# EAGLE design Loop Mux V2 (EAGLE 9.2.2)
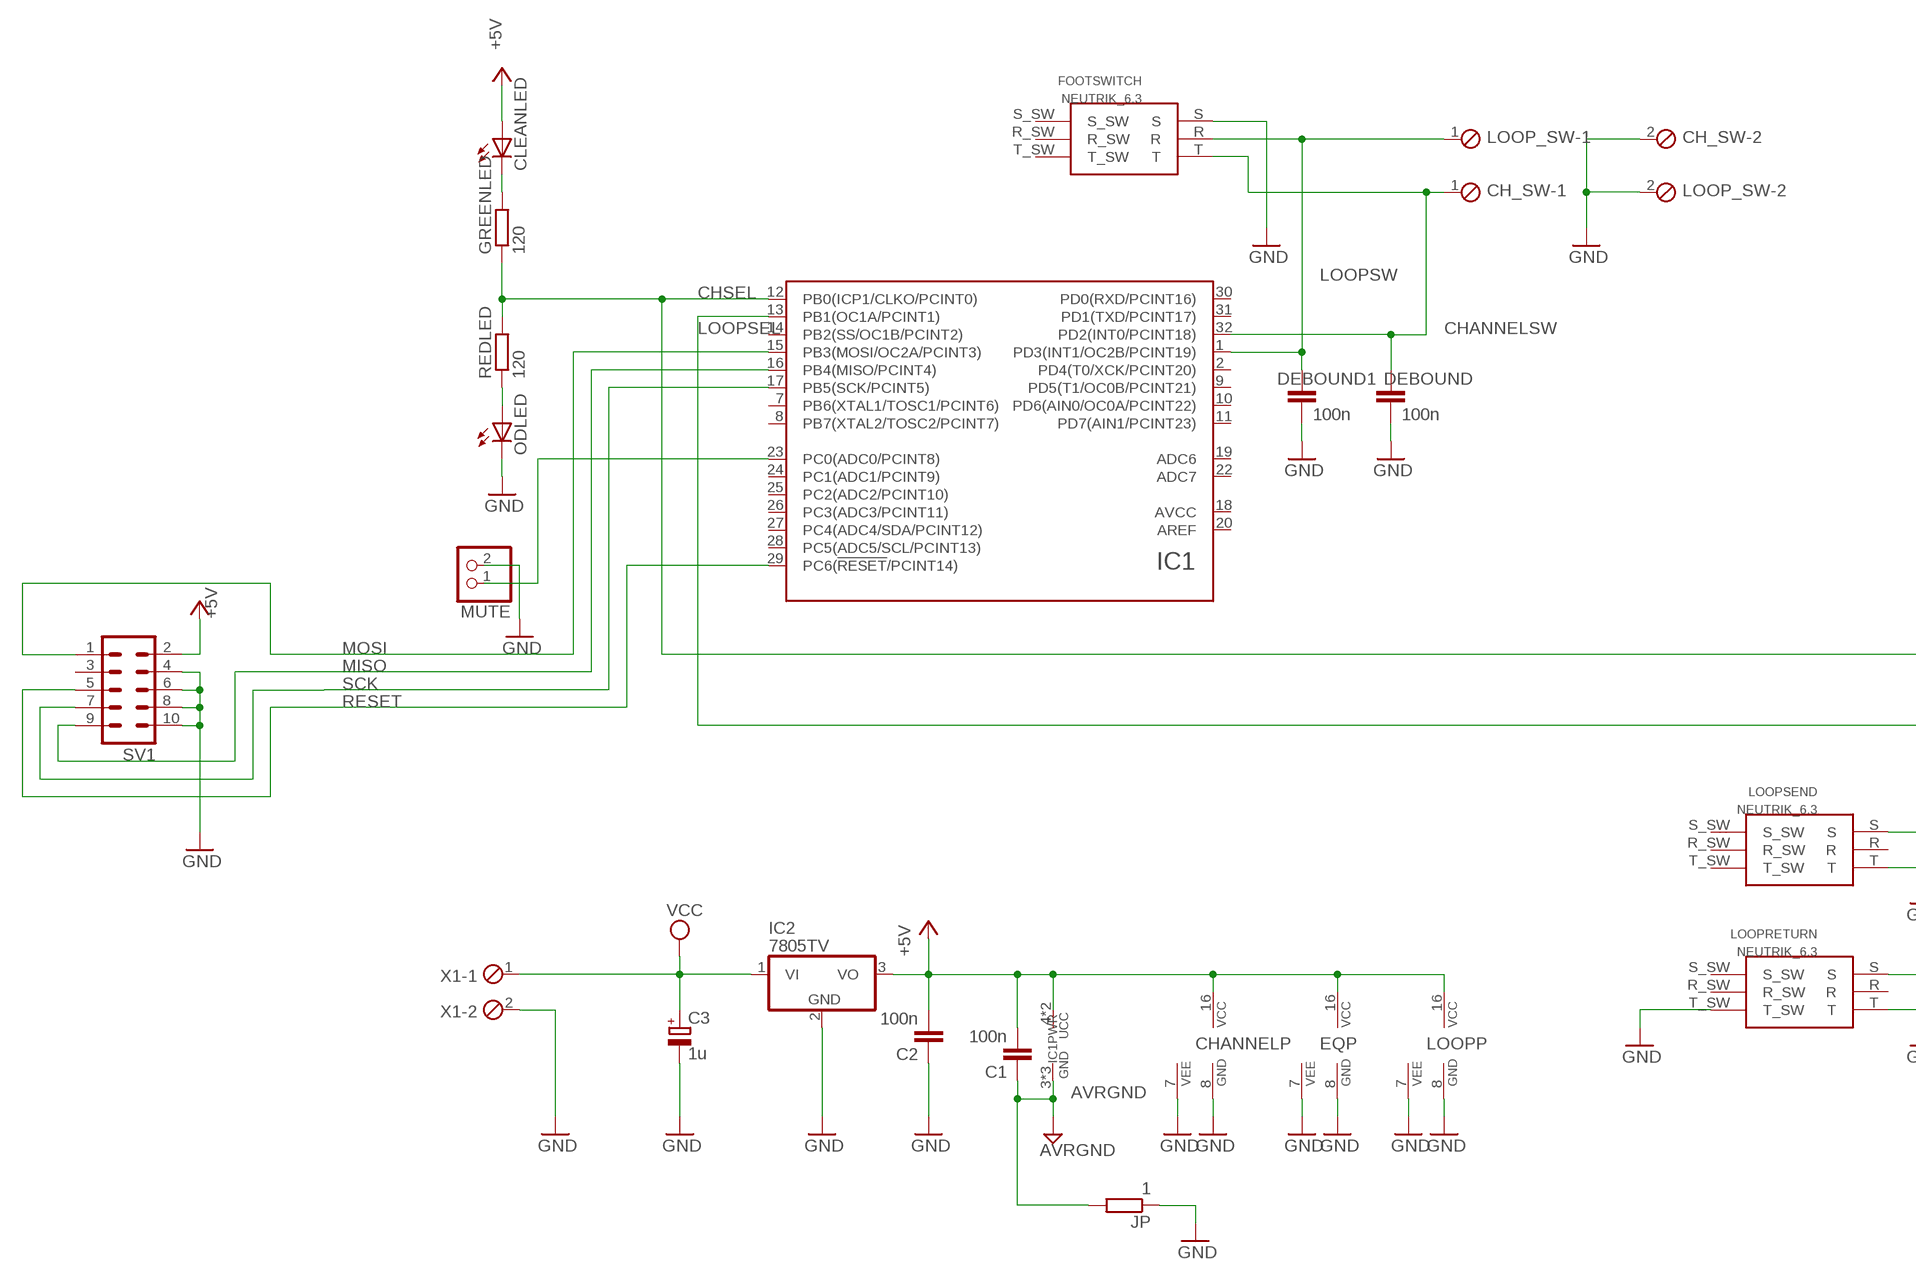
[diagram p0: schematic, sheet 1, part 1 of 2]
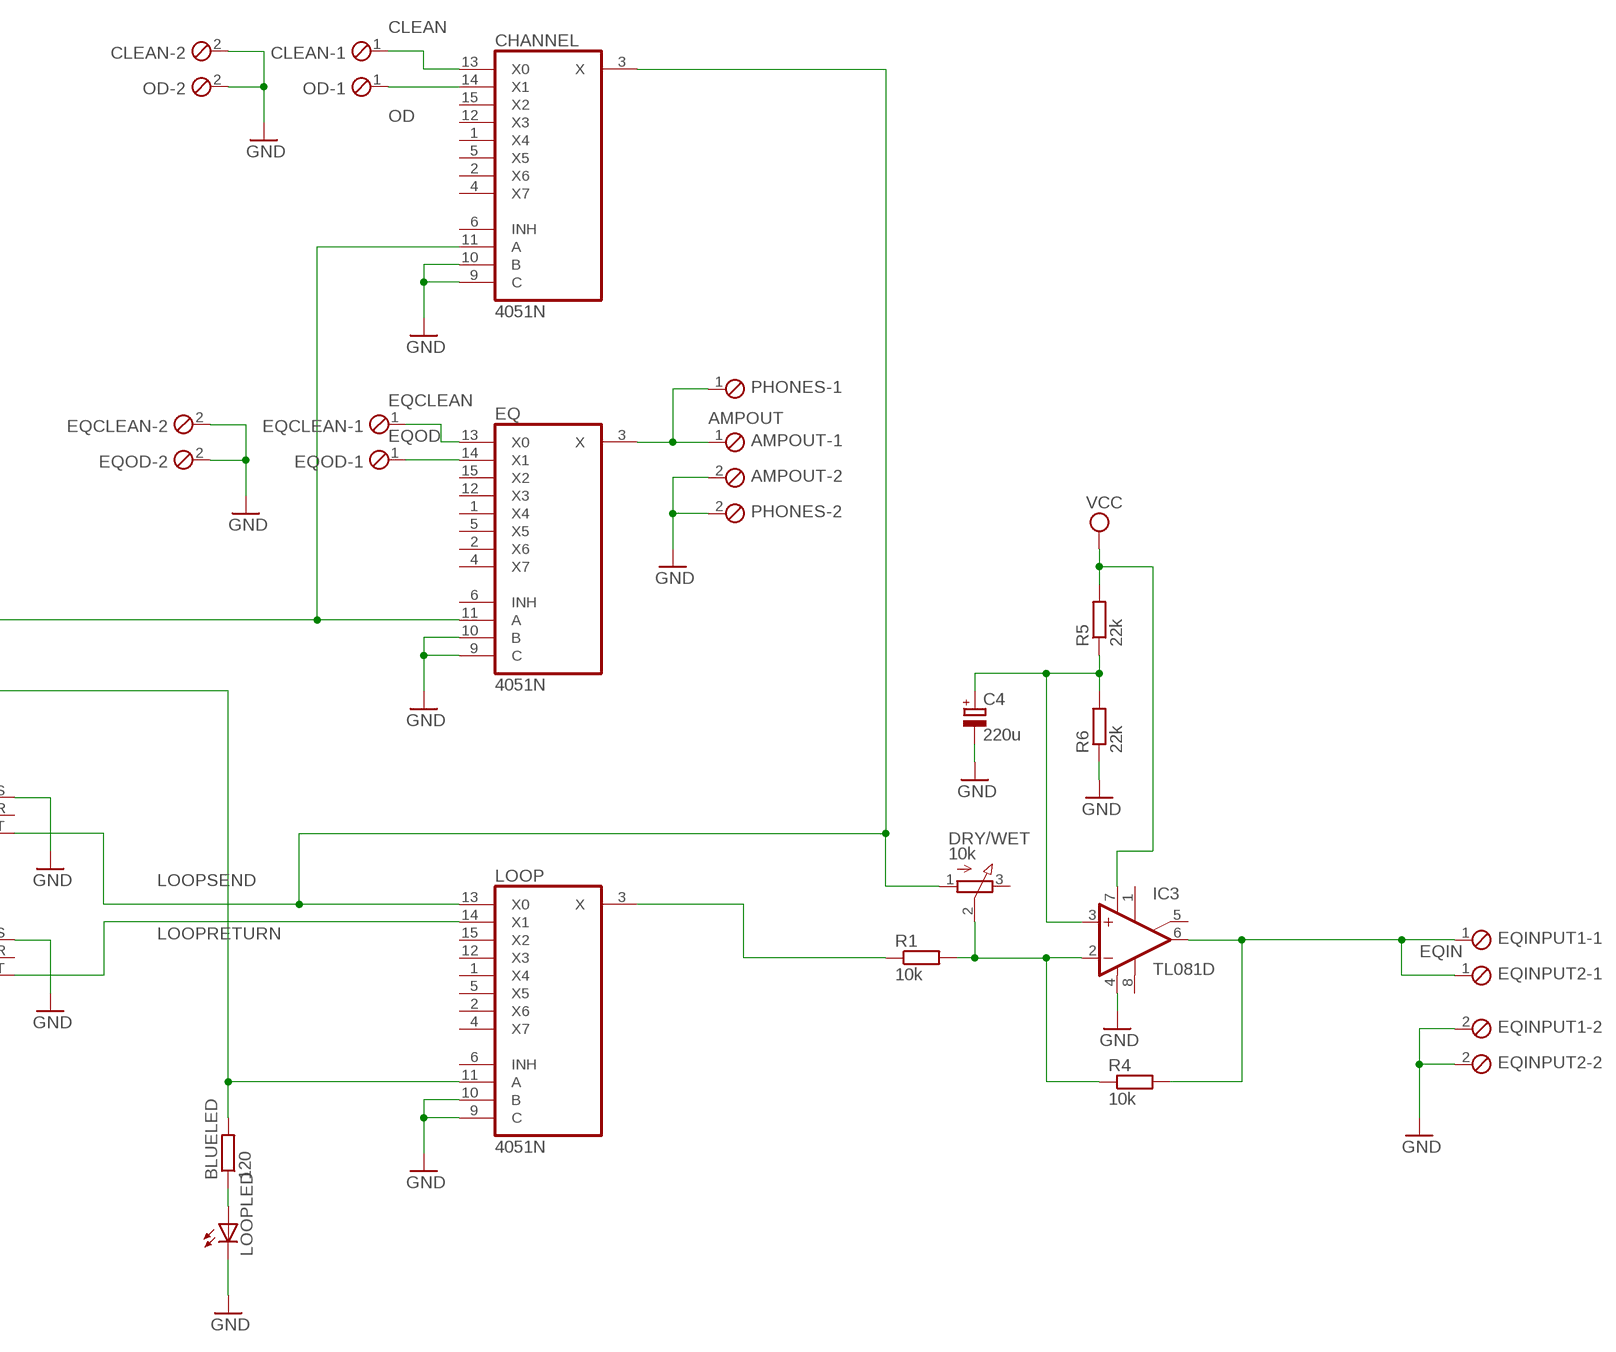
[diagram p1: schematic, sheet 1, part 2 of 2]

## Parts
AMPOUT  MPT2  [2POL254]
BLUELED  120  R-EU_R0805  [R0805]
C1  100n  C-EUC1206  [C1206]
C2  100n  C-EUC1206  [C1206]
C3  1u  CPOL-EUE2-5  [E2-5]
C4  220u  CPOL-EUE2.5-5  [E2,5-5]
CH_SW  MPT2  [2POL254]
CHANNEL  4051N  [DIL16]
CLEAN  MPT2  [2POL254]
CLEANLED  LED5MM  [LED5MM]
DEBOUND  100n  C-EUC1206  [C1206]
DEBOUND1  100n  C-EUC1206  [C1206]
DRY/WET  10k  3RP/1610N  [3RP/1610N]
EQ  4051N  [DIL16]
EQCLEAN  MPT2  [2POL254]
EQINPUT1  MPT2  [2POL254]
EQINPUT2  MPT2  [2POL254]
EQOD  MPT2  [2POL254]
FOOTSWITCH  NEUTRIK_6.3  [NEUTRIK_6.3]
GREENLED  120  R-EU_R0805  [R0805]
IC1  ATMEGA48/88/168/328-AU  [TQFP32-08]
IC2  7805TV  [TO220V]
IC3  TL081D  [SO08]
JP  1  R-EU_R0805  [R0805]
LOOP  4051N  [DIL16]
LOOP_SW  MPT2  [2POL254]
LOOPLED  LED5MM  [LED5MM]
LOOPRETURN  NEUTRIK_6.3  [NEUTRIK_6.3]
LOOPSEND  NEUTRIK_6.3  [NEUTRIK_6.3]
MUTE  PINHD-1X2  [1X02]
OD  MPT2  [2POL254]
ODLED  LED5MM  [LED5MM]
PHONES  MPT2  [2POL254]
R1  10k  R-EU_R0805  [R0805]
R4  10k  R-EU_R0805  [R0805]
R5  22k  R-EU_R0805  [R0805]
R6  22k  R-EU_R0805  [R0805]
REDLED  120  R-EU_R0805  [R0805]
SV1  MA05-2  [MA05-2]
X1  MPT2  [2POL254]

## Nets
+5V: C1.2 C2.2 CHANNEL.16(VCC) CLEANLED.A EQ.16(VCC) IC1.4(UCC) IC1.6(UCC) IC2.3(VO) LOOP.16(VCC) SV1.2
AMPOUT: AMPOUT.1 EQ.3(X) PHONES.1
AVRGND: C1.1 IC1.3(GND) IC1.5(GND) IC1.21(GND) JP.2
CHANNELSW: CH_SW.1 DEBOUND.1 FOOTSWITCH.T IC1.32(PD2(INT0/PCINT18))
CHSEL: CHANNEL.11(A) EQ.11(A) GREENLED.1 IC1.12(PB0(ICP1/CLKO/PCINT0)) REDLED.2
CLEAN: CHANNEL.13(X0) CLEAN.1
EQCLEAN: EQ.13(X0) EQCLEAN.1
EQIN: EQINPUT1.1 EQINPUT2.1 IC3.6(OUT) R4.2
EQOD: EQ.14(X1) EQOD.1
GND: AMPOUT.2 C2.1 C3.- C4.- CH_SW.2 CHANNEL.7(VEE) CHANNEL.8(GND) CHANNEL.9(C) CHANNEL.10(B) CLEAN.2 DEBOUND1.2 DEBOUND.2 EQ.7(VEE) EQ.8(GND) EQ.9(C) EQ.10(B) EQCLEAN.2 EQINPUT1.2 EQINPUT2.2 EQOD.2 FOOTSWITCH.S IC2.2(GND) IC3.4(V-) JP.1 LOOP.7(VEE) LOOP.8(GND) LOOP.9(C) LOOP.10(B) LOOP_SW.2 LOOPLED.K(C) LOOPRETURN.S LOOPRETURN.T_SW LOOPSEND.S MUTE.2 OD.2 ODLED.K(C) PHONES.2 R6.1 SV1.4 SV1.6 SV1.8 SV1.10 X1.2
LOOPRETURN: LOOP.14(X1) LOOPRETURN.T
LOOPSEL: BLUELED.2 IC1.13(PB1(OC1A/PCINT1)) LOOP.11(A)
LOOPSEND: CHANNEL.3(X) DRY/WET.1(A) LOOP.13(X0) LOOPSEND.T
LOOPSW: DEBOUND1.1 FOOTSWITCH.R IC1.1(PD3(INT1/OC2B/PCINT19)) LOOP_SW.1
MISO: IC1.16(PB4(MISO/PCINT4)) SV1.9
MOSI: IC1.15(PB3(MOSI/OC2A/PCINT3)) SV1.1
N$1: ODLED.A REDLED.1
N$2: IC1.23(PC0(ADC0/PCINT8)) MUTE.1
N$3: CLEANLED.K(C) GREENLED.2
N$7: LOOP.3(X) R1.1
N$9: DRY/WET.2(S) IC3.2(-IN) R1.2 R4.1
N$10: BLUELED.1 LOOPLED.A
N$12: C4.+ IC3.3(+IN) R5.1 R6.2
OD: CHANNEL.14(X1) OD.1
RESET: IC1.29(PC6(!RESET!/PCINT14)) SV1.5
SCK: IC1.17(PB5(SCK/PCINT5)) SV1.7
VCC: C3.+ IC2.1(VI) IC3.7(V+) R5.2 X1.1
Unconnected: CHANNEL.1(X4) CHANNEL.2(X6) CHANNEL.4(X7) CHANNEL.5(X5) CHANNEL.6(INH) CHANNEL.12(X3) CHANNEL.15(X2) DRY/WET.3(E) EQ.1(X4) EQ.2(X6) EQ.4(X7) EQ.5(X5) EQ.6(INH) EQ.12(X3) EQ.15(X2) FOOTSWITCH.R_SW FOOTSWITCH.S_SW FOOTSWITCH.T_SW IC1.2(PD4(T0/XCK/PCINT20)) IC1.7(PB6(XTAL1/TOSC1/PCINT6)) IC1.8(PB7(XTAL2/TOSC2/PCINT7)) IC1.9(PD5(T1/OC0B/PCINT21)) IC1.10(PD6(AIN0/OC0A/PCINT22)) IC1.11(PD7(AIN1/PCINT23)) IC1.14(PB2(SS/OC1B/PCINT2)) IC1.19(ADC6) IC1.20(AREF) IC1.22(ADC7) IC1.24(PC1(ADC1/PCINT9)) IC1.25(PC2(ADC2/PCINT10)) IC1.26(PC3(ADC3/PCINT11)) IC1.27(PC4(ADC4/SDA/PCINT12)) IC1.28(PC5(ADC5/SCL/PCINT13)) IC1.30(PD0(RXD/PCINT16)) IC1.31(PD1(TXD/PCINT17)) IC3.1(ON1) IC3.5(ON2) IC3.8(OPT) LOOP.1(X4) LOOP.2(X6) LOOP.4(X7) LOOP.5(X5) LOOP.6(INH) LOOP.12(X3) LOOP.15(X2) LOOPRETURN.R LOOPRETURN.R_SW LOOPRETURN.S_SW LOOPSEND.R LOOPSEND.R_SW LOOPSEND.S_SW LOOPSEND.T_SW SV1.3

## Power pins joined to a net without a drawn wire
AVCC: IC1.18(AVCC)

## Library data of the parts
AMPOUT CH_SW CLEAN EQCLEAN EQINPUT1 EQINPUT2 EQOD LOOP_SW OD PHONES X1 = con-phoenix-254:MPT2: PHOENIX CONNECTOR; OC_FARNELL: unknown; OC_NEWARK: unknown
BLUELED GREENLED JP R1 R4-R6 REDLED = rcl:R-EU_: RESISTOR, European symbol; SPICEPREFIX: R
C1 C2 DEBOUND DEBOUND1 = rcl:C-EU: CAPACITOR, European symbol; SPICEPREFIX: C
C3 C4 = rcl:CPOL-EU: POLARIZED CAPACITOR, European symbol; SPICEPREFIX: C
CHANNEL EQ LOOP = 40xx:4051: 8-channel ANALOG MULTIPLEXER
CLEANLED LOOPLED ODLED = led:LED: LED OSRAM: - CHIPLED LG R971, LG N971, LY N971, LG Q971, LY Q971, LO R971, LY R971 LH N974, LH R974 LS Q976, LO Q976, LY Q976 LO Q996 - Hyper CHIPLED LW Q18S LB Q993, LB Q99A, LB R99A - SideLED LS A670, LO A670, LY A670, LG A670, LP A670 LB A673, LV A673, LT A673, LW A673 LH A674 LY A675 LS A676, LA A676, LO A676, LY A676, LW A676 LS A679, LY A679, LG A679 - Hyper Micro SIDELED® LS Y876, LA Y876, LO Y876, LY Y876 LT Y87S - SmartLED LW L88C, LW L88S LB L89C, LB L89S, LG L890 LS L89K, LO L89K, LY L89K LS L896, LA L896, LO L896, LY L896 - TOPLED LS T670, LO T670, LY T670, LG T670, LP T670 LSG T670, LSP T670, LSY T670, LOP T670, LYG T670 LG T671, LOG T671, LSG T671 LB T673, LV T673, LT T673, LW T673 LH T674 LS T676, LA T676, LO T676, LY T676, LB T676, LH T676, LSB T676, LW T676 LB T67C, LV T67C, LT T67C, LS T67K, LO T67K, LY T67K, LW E67C LS E67B, LA E67B, LO E67B, LY E67B, LB E67C, LV E67C, LT E67C LW T67C LS T679, LY T679, LG T679 LS T770, LO T770, LY T770, LG T770, LP T770 LB T773, LV T773, LT T773, LW T773 LH T774 LS E675, LA E675, LY E675, LS T675 LS T776, LA T776, LO T776, LY T776, LB T776 LHGB T686 LT T68C, LB T68C - Hyper Mini TOPLED® LB M676 - Mini TOPLED Santana® LG M470 LS M47K, LO M47K, LY M47K Source: http://www.osram.convergy.de LUXEON: - LUMILED® LXK2-PW12-R00, LXK2-PW12-S00, LXK2-PW14-U00, LXK2-PW14-V00 LXK2-PM12-R00, LXK2-PM12-S00, LXK2-PM14-U00 LXK2-PE12-Q00, LXK2-PE12-R00, LXK2-PE12-S00, LXK2-PE14-T00, LXK2-PE14-U00 LXK2-PB12-K00, LXK2-PB12-L00, LXK2-PB12-M00, LXK2-PB14-N00, LXK2-PB14-P00, LXK2-PB14-Q00 LXK2-PR12-L00, LXK2-PR12-M00, LXK2-PR14-Q00, LXK2-PR14-R00 LXK2-PD12-Q00, LXK2-PD12-R00, LXK2-PD12-S00 LXK2-PH12-R00, LXK2-PH12-S00 LXK2-PL12-P00, LXK2-PL12-Q00, LXK2-PL12-R00 Source: www.luxeon.com KINGBRIGHT: KA-3528ASYC Source: www.kingbright.com
DRY/WET = pot:3RP/1610N: 16mm Potentiometer one level Source: http://www.alphapotentiometers.net/html/16mm_pot_2.html
FOOTSWITCH LOOPRETURN LOOPSEND = jack 6.3 pcb:NEUTRIK_6.3: 6.35 mm stereo jack socket
IC1 = atmel_tiny24-44-84tiny48-88mega48-88-168-328:ATMEGA48/88/168/328
IC2 = linear:78*: Positive VOLTAGE REGULATOR Source: http://cache.national.com/ds/LM/LM78L05.pdf http://www.fairchildsemi.com/ds/LM/LM7805.pdf
IC3 = linear:TL081: OP AMP
MUTE = pinhead:PINHD-1X2: PIN HEADER
SV1 = con-lstb:MA05-2: PIN HEADER; OC_FARNELL: unknown; OC_NEWARK: unknown

## Board
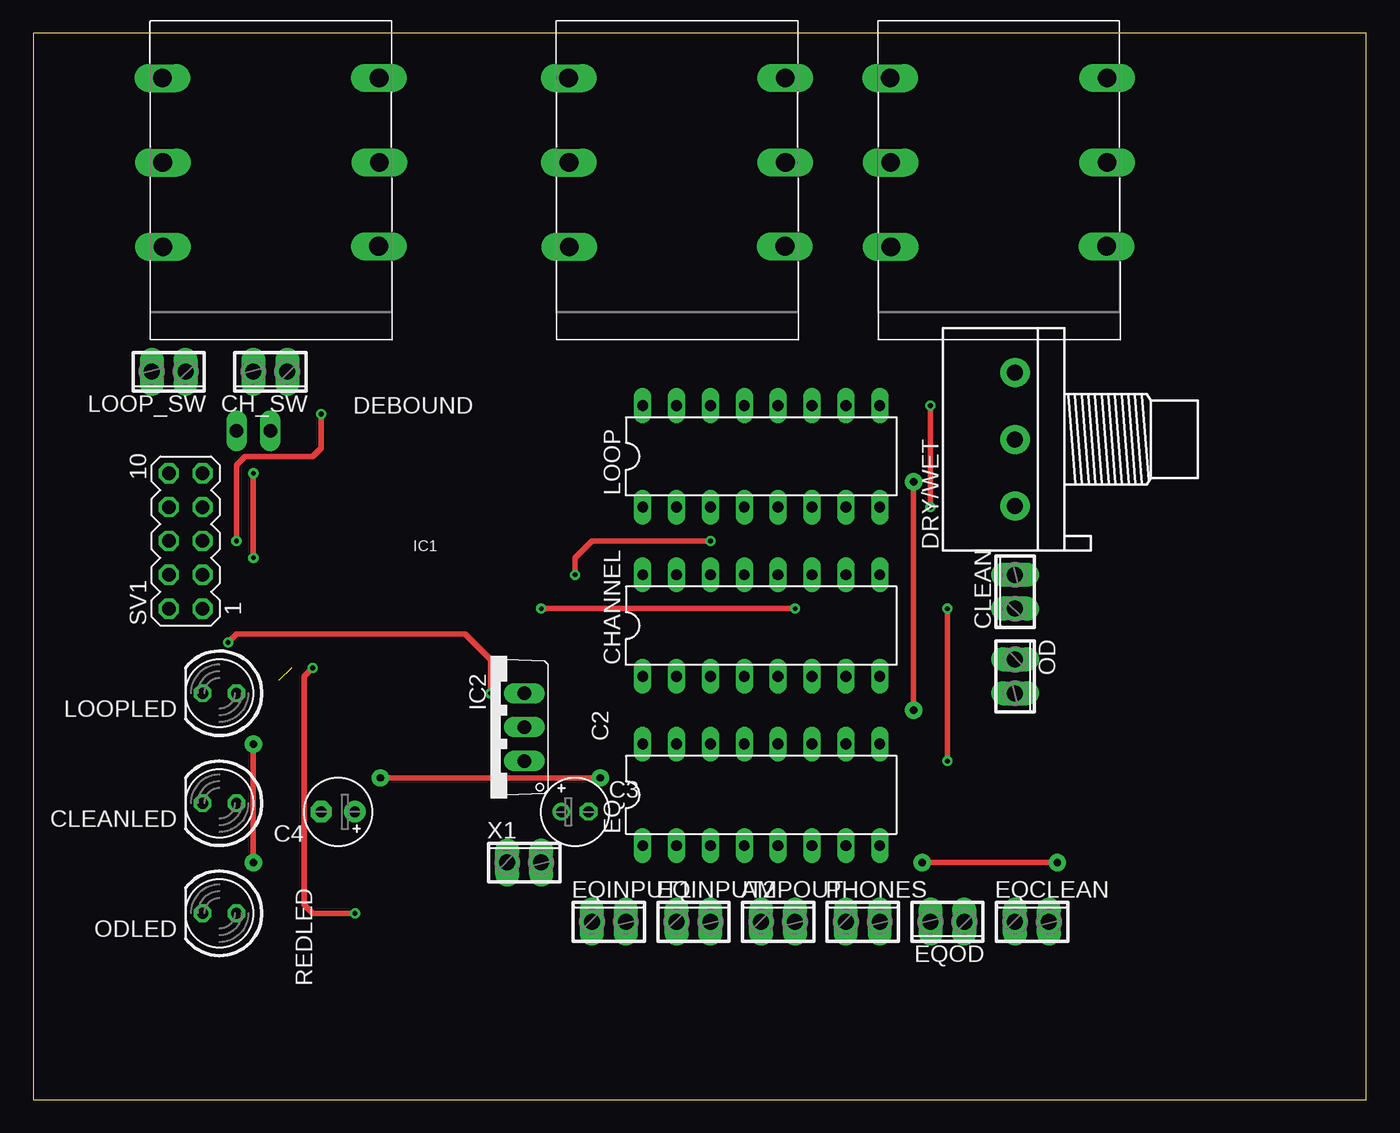
[diagram p2: board, top side]
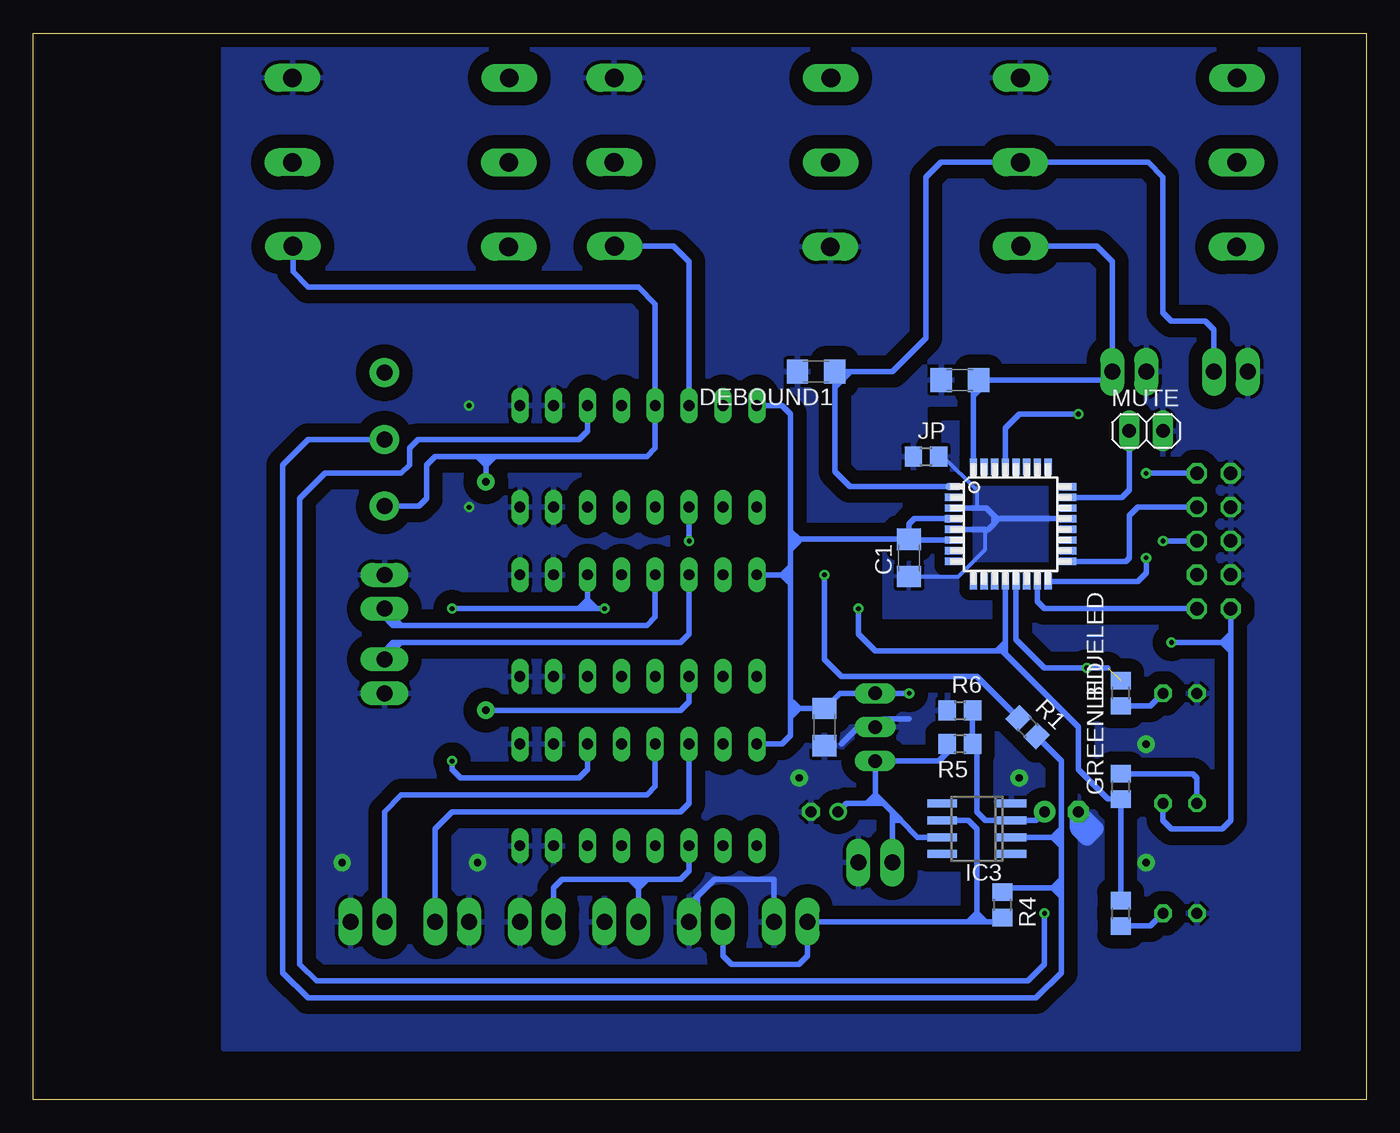
[diagram p3: board, bottom side, seen from below]

Size 100 x 80 mm. Coordinates in mm from the lower left corner, seen from the top.
Outline: 0,0 100,0 100,80 0,80 0,0
Copper layers (1*16): Top 0.035mm / dielectric 1.5mm / Bottom 0.035mm
Design rules "default": minimum track width 6mil, minimum drill 0.35mm, track to track 6mil, track to pad 6mil, pad to pad 6mil, via to via 6mil, smd to smd 6mil, copper to edge 40mil, drill to drill 6mil, minimum pad ring 10mil, minimum via ring 8mil, stop-mask expansion 4mil, vias tented up to drill 0mil, thermal gap 10mil

### Footprints (pad centres in the part's own frame; a part is rotated, then mirrored left to right if it is on the bottom)
2POL254 = drill 1.2 long: 1 -1.27,0; 2 1.27,0
R0805 = smd 1.3 x 1.5: 1 -0.95,0; 2 0.95,0
C1206 = smd 1.6 x 1.8: 1 -1.4,0; 2 1.4,0
E2-5 = drill 0.813 pad 1.27: + -1.016,0 | drill 0.813 pad 1.27 octagon: - 1.016,0
E2,5-5 = drill 0.813 pad 1.6: + -1.27,0 | drill 0.813 pad 1.6 octagon: - 1.27,0
DIL16 = drill 0.813 long: 1 -8.89,-3.81; 2 -6.35,-3.81; 3 -3.81,-3.81; 4 -1.27,-3.81; 5 1.27,-3.81; 6 3.81,-3.81; 7 6.35,-3.81; 8 8.89,-3.81; 9 8.89,3.81; 10 6.35,3.81; 11 3.81,3.81; 12 1.27,3.81; 13 -1.27,3.81; 14 -3.81,3.81; 15 -6.35,3.81; 16 -8.89,3.81
LED5MM = drill 0.813 octagon: A -1.27,0; K 1.27,0
3RP/1610N = drill 1.2 pad 2.184: 1 -5,0; 2 0,0; 3 5,0
NEUTRIK_6.3 = drill 1.4 long: R 14.52,-4.61; R_SW -1.72,-4.62; S 14.51,1.73; S_SW -1.75,1.71; T 14.48,-10.9; T_SW -1.7,-10.95
TQFP32-08 = smd 1.27 x 0.55: 1 -4.293,2.8; 2 -4.293,2; 3 -4.293,1.2; 4 -4.293,0.4; 5 -4.293,-0.4; 6 -4.293,-1.2; 7 -4.293,-2; 8 -4.293,-2.8; 17 4.293,-2.8; 18 4.293,-2; 19 4.293,-1.2; 20 4.293,-0.4; 21 4.293,0.4; 22 4.293,1.2; 23 4.293,2; 24 4.293,2.8 | smd 0.55 x 1.27: 9 -2.8,-4.293; 10 -2,-4.293; 11 -1.2,-4.293; 12 -0.4,-4.293; 13 0.4,-4.293; 14 1.2,-4.293; 15 2,-4.293; 16 2.8,-4.293; 25 2.8,4.293; 26 2,4.293; 27 1.2,4.293; 28 0.4,4.293; 29 -0.4,4.293; 30 -1.2,4.293; 31 -2,4.293; 32 -2.8,4.293
TO220V = drill 1.016 long: 1 -2.54,-2.54; 2 0,-2.54; 3 2.54,-2.54
SO08 = smd 0.6 x 2.2: 1 -1.905,-2.6; 2 -0.635,-2.6; 3 0.635,-2.6; 4 1.905,-2.6; 5 1.905,2.6; 6 0.635,2.6; 7 -0.635,2.6; 8 -1.905,2.6
1X02 = drill 1.016 long: 1 -1.27,0; 2 1.27,0
MA05-2 = drill 1.016 octagon: 1 -5.08,-1.27; 2 -5.08,1.27; 3 -2.54,-1.27; 4 -2.54,1.27; 5 0,-1.27; 6 0,1.27; 7 2.54,-1.27; 8 2.54,1.27; 9 5.08,-1.27; 10 5.08,1.27

### Placement (x,y rotation side)
AMPOUT  55.88,13.34 0 top
BLUELED  18.41,30.48 90 bottom
C1  34.29,40.64 90 bottom
C2  40.64,27.94 90 bottom
C3  40.64,21.59 0 top
C4  22.86,21.59 180 top
CH_SW  17.78,54.61 180 top
CHANNEL  54.61,35.56 0 top
CLEAN  73.66,38.1 90 top
CLEANLED  13.97,22.23 180 top
DEBOUND  30.48,53.98 180 bottom
DEBOUND1  41.27,54.61 180 bottom
DRY/WET  73.66,49.53 90 top
EQ  54.61,22.86 0 top
EQCLEAN  74.93,13.34 0 top
EQINPUT1  43.18,13.34 0 top
EQINPUT2  49.53,13.34 0 top
EQOD  68.58,13.34 180 top
FOOTSWITCH  11.43,74.93 0 top
GREENLED  18.41,23.5 90 bottom
IC1  26.67,43.18 0 bottom
IC2  34.29,27.94 90 top
IC3  29.21,20.32 90 bottom
JP  33.02,48.26 0 bottom
LOOP  54.61,48.26 0 top
LOOP_SW  10.16,54.61 180 top
LOOPLED  13.97,30.48 180 top
LOOPRETURN  41.91,74.93 0 top
LOOPSEND  66.04,74.93 0 top
MUTE  16.51,50.16 0 bottom
OD  73.66,31.75 270 top
ODLED  13.97,13.97 180 top
PHONES  62.23,13.34 0 top
R1  25.4,27.94 315 bottom
R4  27.3,14.61 270 bottom
R5  30.48,26.67 180 bottom
R6  30.48,29.21 0 bottom
REDLED  18.41,13.97 90 bottom
SV1  11.43,41.91 90 top
X1  36.83,17.78 0 top

### Tracks (layer width: path | path; a pad name or v marks a point on that pad's centre or on a via)
+5V  (via drill 0.35)
  Top 0.406: v34.29,30.48 34.29,33.02 32.38,34.92 15.24,34.92 v14.61,34.29
  Bottom 0.406: IC1.6 34.23,41.98 C1.2 | 43.18,40.01 43.18,41.27 | 43.18,41.53 43.18,42.55 | 43.18,42.55 43.18,42.67 | 43.18,42.67 43.18,51.44 43.81,52.07 LOOP.16 | 43.18,40.01 43.18,39.37 | 43.18,39.37 43.18,38.73 | 43.18,38.73 43.18,29.84 | 43.18,29.84 43.18,29.21 | SV1.2 10.16,34.92 | 10.16,34.92 10.16,34.29 | 10.16,34.29 10.16,33.66 | 10.16,33.66 10.79,34.29 | 10.79,34.29 v14.61,34.29 | v34.29,30.48 IC2.3 39.5,30.48 C2.2 42.55,29.34 | 10.16,33.66 10.16,20.95 10.79,20.32 14.61,20.32 15.24,20.95 CLEANLED.A | 43.18,29.21 43.05,29.34 42.55,29.34 | 43.18,29.21 43.18,28.7 | 43.18,28.7 43.18,27.3 43.81,26.67 EQ.16 | 42.55,29.34 43.18,28.7 | 42.55,29.34 43.05,29.84 43.18,29.84 | CHANNEL.16 43.81,39.37 | 43.81,39.37 43.18,39.37 | 43.81,39.37 43.18,40.01 | 43.81,39.37 43.18,38.73 | C1.2 34.29,43.18 33.89,43.58 IC1.4 | 42.67,42.04 43.18,42.55 | C1.2 42.55,42.04 | 43.18,41.27 42.55,41.91 42.55,42.04 | 42.55,42.04 43.18,42.67 | 42.67,42.04 42.55,42.04 | 42.67,42.04 43.18,41.53 | 43.18,41.53 43.18,41.27 | 10.79,34.29 10.16,34.29 | 10.79,34.29 10.16,34.92
AMPOUT
  Bottom 0.406: EQ.3 50.8,17.14 51.44,16.51 53.98,16.51 | 53.98,16.51 54.61,16.51 | 54.61,16.51 54.61,15.88 | 54.61,15.88 AMPOUT.1 | 54.61,16.51 55.24,16.51 | 55.24,16.51 60.33,16.51 60.96,15.88 PHONES.1 | 54.61,15.88 55.24,16.51 | 54.61,15.88 53.98,16.51
AVRGND
  Bottom 0.305: C1.1 30.61,39.24 28.57,41.27 28.57,42.55 | 28.57,42.55 28.57,42.78 | 28.57,42.55 28.34,42.78 | 28.57,42.55 28.81,42.78 29.21,42.78 | 29.21,44.38 29.21,45.72 31.75,48.26 JP.2
  Bottom 0.406: IC1.3 29.21,44.38 28.5,44.38 27.94,43.81 | 27.94,43.81 27.94,43.18 | 27.94,43.18 28.34,42.78 28.57,42.78 29.21,42.78 IC1.5 | IC1.21 27.54,43.58 | 27.54,43.58 27.7,43.58 27.94,43.81 | 27.54,43.58 27.94,43.18
  pour Bottom: 24.13,45.72 24.13,40.64 29.21,40.64 29.21,45.72
  pour Bottom (isolate 0.813): 20.32,50.8 31.75,50.8 31.75,46.99 36.2,46.99 36.2,36.83 36.2,36.2 19.68,36.2 19.68,50.8
CHANNELSW
  Bottom 0.305: 27.94,53.98 28.2,53.98 29.47,52.7
  Bottom 0.406: 29.47,48 IC1.32 29.47,52.7 29.47,53.59 DEBOUND.1 27.94,53.98 19.68,53.98 CH_SW.1 | 19.05,53.34 CH_SW.1 | FOOTSWITCH.T 20.21,64.03 19.05,62.87 CH_SW.1
CHSEL  (via drill 0.35)
  Top 0.406: v68.58,25.4 v68.58,36.83 | v38.1,36.83 v57.15,36.83
  Bottom 0.406: EQ.11 58.42,24.77 59.05,24.13 67.94,24.13 68.58,24.77 v68.58,25.4 | CHANNEL.11 58.42,37.47 | 58.42,37.47 59.05,36.83 | 59.05,36.83 v68.58,36.83 | 59.05,36.83 58.42,36.83 | 58.42,36.83 57.78,36.83 | 57.78,36.83 v57.15,36.83 | v38.1,36.83 38.1,34.92 36.83,33.66 27.7,33.66 | 27.7,33.66 27.3,33.66 | 27.3,33.66 27.07,33.42 | 27.07,33.42 21.59,27.94 21.59,24.77 19.37,22.55 GREENLED.1 | GREENLED.1 18.73,22.55 | GREENLED.1 REDLED.2 | 58.42,37.47 57.78,36.83 | 58.42,37.47 58.42,36.83 | 27.07,33.89 27.3,33.66 | IC1.12 27.07,34.29 | 27.07,34.29 27.07,33.89 | 27.07,34.29 27.7,33.66 | 27.07,33.42 27.07,33.89
CLEAN
  Bottom 0.406: CHANNEL.13 53.34,36.2 53.98,35.56 72.39,35.56 | CLEAN.1 73.66,36.2 73.03,35.56 | 72.39,35.56 73.03,35.56 | 73.03,35.56 73.03,36.2 72.39,35.56
EQCLEAN
  Bottom 0.406: EQ.13 53.34,23.5 53.98,22.86 72.39,22.86 73.66,21.59 EQCLEAN.1
EQIN
  Bottom 0.406: IC3.6 29.84,20.95 29.21,20.32 29.21,13.97 | EQINPUT2.1 48.26,10.79 47.62,10.16 42.55,10.16 41.91,10.79 EQINPUT1.1 29.84,13.34 | R4.2 27.62,13.34 28.57,13.34 | 29.84,13.34 29.21,13.34 | 29.21,13.34 28.57,13.34 | 29.21,13.97 28.57,13.34 | 29.21,13.97 29.84,13.34 | 29.21,13.97 29.21,13.34
EQOD
  Bottom 0.406: EQ.14 50.8,22.23 51.44,21.59 68.58,21.59 69.85,20.32 EQOD.1
GND  (via drill 0.35, 0.55 pad 1.3)
  Top 0.406: v67.31,52.07 v67.31,44.45 | v76.83,17.78 v66.67,17.78 | v16.51,26.67 v16.51,17.78 | v26.04,24.13 v42.55,24.13
  Bottom 0.406: 34.29,28.57 36.2,28.57 IC2.2 38.1,27.94 39.37,26.67 | 50.16,15.24 50.16,13.97 EQINPUT2.2 50.8,14.61 48.9,16.51 44.45,16.51 EQINPUT1.2
  Bottom 1.27: C4.- 20.32,20.32 20.95,19.68 21.59,20.32 C4.-
  pour Bottom (isolate 1.016, rank 2): 5.08,80.01 5.08,3.81 85.72,3.81 85.72,80.01
LOOPRETURN
  Bottom 0.406: LOOPRETURN.T 51.97,64.03 50.8,62.87 LOOP.14
LOOPSEL  (via drill 0.35)  (1 unrouted)
  Top 0.406: v20.95,32.38 20.32,31.75 20.32,14.61 20.95,13.97 v24.13,13.97
  Bottom 0.406: LOOP.11 58.42,50.16 59.05,49.53 71.12,49.53 71.75,48.9 71.75,47.62 72.39,46.99 78.11,46.99 80.01,45.09 80.01,10.16 78.74,8.89 25.4,8.89 24.13,10.16 v24.13,13.97 | 19.37,32.38 v20.95,32.38 24.13,32.38 26.27,34.52 IC1.13
LOOPSEND  (via drill 0.55 pad 1.3)
  Top 0.406: v66.04,46.35 v66.04,29.21
  Bottom 0.406: 65.41,48.26 53.98,48.26 53.34,48.9 LOOP.13 53.34,59.69 54.61,60.96 79.38,60.96 80.52,62.1 LOOPSEND.T | 65.41,48.26 66.04,48.26 | 66.04,48.26 66.67,48.26 | 66.67,48.26 69.85,48.26 70.48,47.62 70.48,45.09 71.04,44.53 DRY/WET.1 | CHANNEL.3 50.8,29.84 51.44,29.21 v66.04,29.21 | v66.04,46.35 66.04,47.62 | 66.04,47.62 65.41,48.26 | 66.04,47.62 66.67,48.26 | 66.04,47.62 66.04,48.26
LOOPSW
  Bottom 0.305: 38.73,54.61 38.73,54.48 39.88,53.34
  Bottom 0.406: IC1.1 38.73,45.98 39.88,47.12 39.88,53.34 DEBOUND1.1 38.73,54.61 35.56,54.61 33.02,57.15 33.02,69.22 31.91,70.32 FOOTSWITCH.R 16.34,70.32 15.24,69.22 15.24,59.05 14.61,58.42 12.06,58.42 11.43,57.78 LOOP_SW.1
MISO  (via drill 0.35)
  Top 0.406: v16.51,46.99 v16.51,40.64
  Bottom 0.406: IC1.16 17.14,38.89 16.51,39.52 v16.51,40.64 | SV1.9 v16.51,46.99
MOSI
  Bottom 0.406: IC1.15 24.67,37.37 24.13,36.83 SV1.1
N$1
  Bottom 0.406: ODLED.A 16.19,13.02 REDLED.1
N$2
  Bottom 0.406: MUTE.1 17.78,45.72 18.32,45.18 IC1.23
N$3
  Bottom 0.406: CLEANLED.K 12.7,24.13 13.02,24.45 GREENLED.2
N$7  (via drill 0.35)
  Top 0.406: v50.8,41.91 41.91,41.91 40.64,40.64 v40.64,39.37
  Bottom 0.406: LOOP.3 v50.8,41.91 | R1.1 26.35,28.89 29.21,31.75 39.37,31.75 40.64,33.02 v40.64,39.37
N$9
  Bottom 0.406: DRY/WET.2 79.38,49.53 81.28,47.62 81.28,9.53 79.38,7.62 24.77,7.62 22.86,9.53 22.86,15.24 | R1.2 22.86,25.4 | 22.86,25.4 | 22.86,25.4 22.86,20.32 | 22.86,20.32 22.86,19.68 | 22.86,19.68 22.86,19.05 | 22.86,19.05 22.86,16.51 | 22.86,16.51 22.86,15.88 | 22.86,15.88 22.86,15.24 | IC3.2 23.5,19.68 | 23.5,19.68 22.86,19.05 | 23.5,19.68 22.86,19.68 | 23.5,19.68 22.86,20.32 | R4.1 26.98,15.88 23.5,15.88 | 23.5,15.88 22.86,15.88 | 23.5,15.88 22.86,16.51 | 23.5,15.88 22.86,15.24
N$10
  Bottom 0.406: LOOPLED.A 16.19,29.53 BLUELED.1
N$12
  Bottom 0.406: IC3.3 27.3,20.95 | R6.2 R5.1 29.21,26.35 29.21,21.59 28.57,20.95 IC3.3 | IC3.3 24.77,20.95 C4.+
OD
  Bottom 0.406: CHANNEL.14 50.8,34.92 51.44,34.29 72.39,34.29 | 72.39,34.29 73.03,34.29 | 73.03,34.29 73.66,33.66 OD.1 72.39,34.29 | 73.03,34.29 73.03,33.66
RESET  (via drill 0.35)
  Top 0.406: v15.24,41.91 15.24,47.62 15.88,48.26 20.95,48.26 21.59,48.9 v21.59,51.44
  Bottom 0.406: IC1.29 27.07,50.4 26.04,51.44 v21.59,51.44 | SV1.5 v15.24,41.91
SCK
  Bottom 0.406: IC1.17 18.04,40.38 17.78,40.64 17.78,43.81 17.14,44.45 SV1.7
VCC
  Bottom 0.406: 32.38,19.68 IC3.7 33.66,19.68 34.92,20.95 | 36.83,22.86 IC2.1 32.06,25.4 31.43,26.04 R5.2 | 39.37,21.59 C3.+ 38.99,22.23 37.47,22.23 | 34.92,20.95 35.56,21.59 | 35.56,21.59 36.2,22.23 | 36.2,22.23 36.83,22.86 | 37.47,22.23 36.83,22.23 | 36.83,22.23 36.2,22.23 | X1.1 35.56,20.95 | 35.56,20.95 35.56,21.59 | 34.92,20.95 35.56,20.95 | 36.83,22.86 36.83,22.23 | 36.83,22.86 37.47,22.23